# EAGLE design CoffeeHeater (EAGLE 9.2.0)
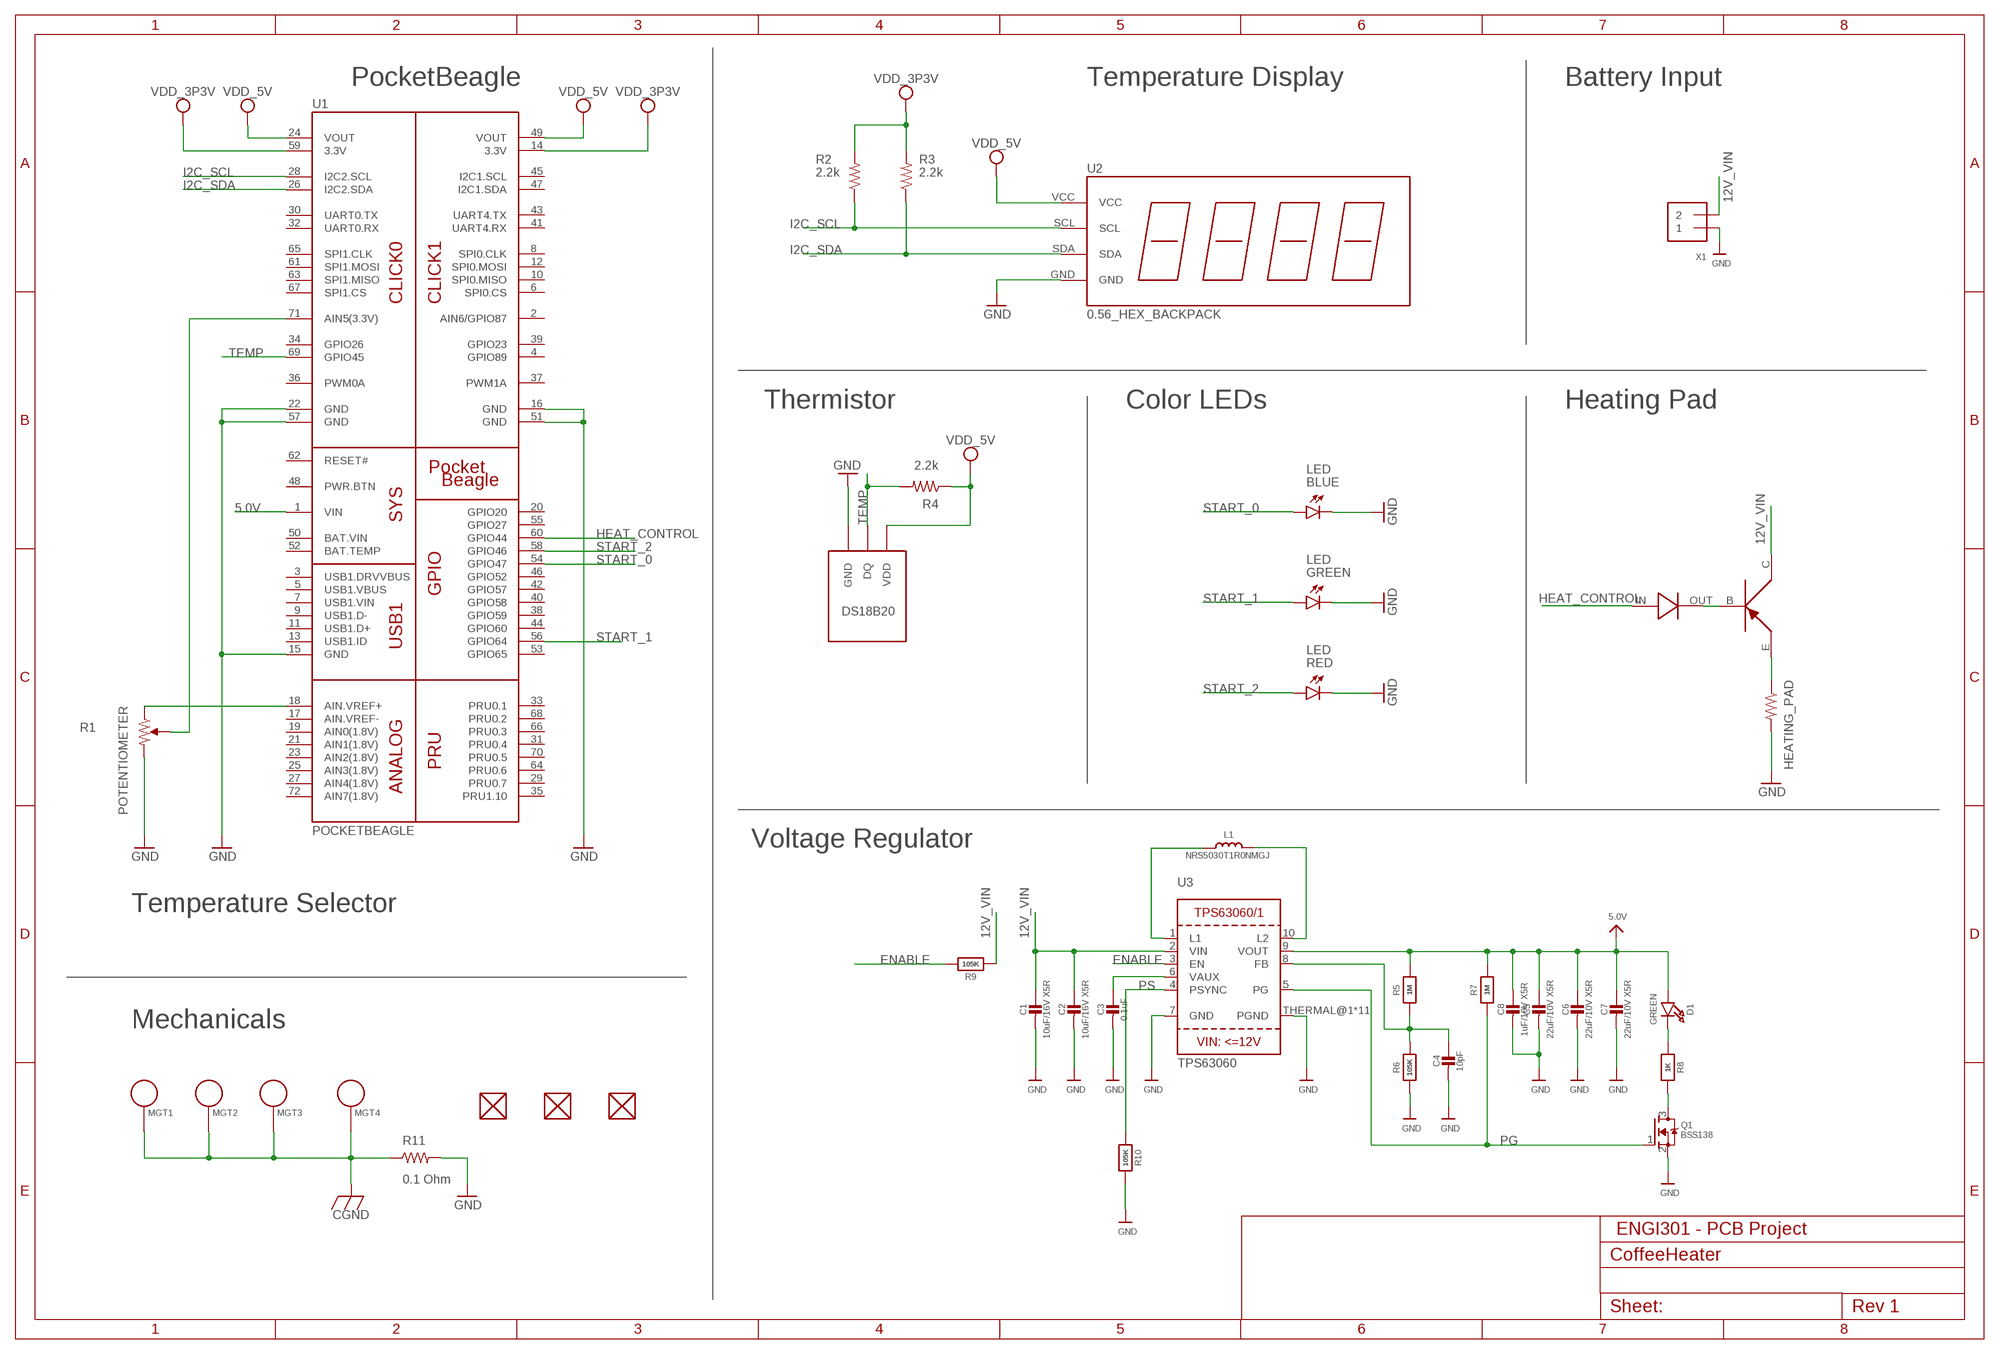
[diagram p0: schematic, sheet 1]

## Parts
BLUE  LED  [EIA-STD]
C1  10uF/16V X5R  CAP_CERAMIC0805-NOOUTLINE  [0805-NO]
C2  10uF/16V X5R  CAP_CERAMIC0805-NOOUTLINE  [0805-NO]
C3  0.1uF  CAP_CERAMIC0805-NOOUTLINE  [0805-NO]
C4  10pF  CAP_CERAMIC0805-NOOUTLINE  [0805-NO]
C5  22uF/10V X5R  CAP_CERAMIC0805-NOOUTLINE  [0805-NO]
C6  22uF/10V X5R  CAP_CERAMIC0805-NOOUTLINE  [0805-NO]
C7  22uF/10V X5R  CAP_CERAMIC0805-NOOUTLINE  [0805-NO]
C8  1uF/10V X5R  CAP_CERAMIC0805-NOOUTLINE  [0805-NO]
D1  GREEN  LED0805_NOOUTLINE  [CHIPLED_0805_NOOUTLINE]
D2  DIODE  [DIODE]
FUD1  FIDUCIAL  [FIDUCIAL_40MIL]
FUD2  FIDUCIAL  [FIDUCIAL_40MIL]
FUD3  FIDUCIAL  [FIDUCIAL_40MIL]
GREEN  LED  [EIA-STD]
H1  HEATING_PAD  [HEATING_PAD]
L1  NRS5030T1R0NMGJ  INDUCTORTDK_VLC5045  [INDUCTOR_5X5MM_TDK_VLC5045]
MGT1  MOUNTING_HOLE  [MOUNTING_HOLE]
MGT2  MOUNTING_HOLE  [MOUNTING_HOLE]
MGT3  MOUNTING_HOLE  [MOUNTING_HOLE]
MGT4  MOUNTING_HOLE  [MOUNTING_HOLE]
Q1  BSS138  MOSFET-NWIDE  [SOT23-WIDE]
R1  POTENTIOMETER  [POT-PO90S]
R2  2.2k  R_R0603  [R0603]
R3  2.2k  R_R0603  [R0603]
R4  2.2k  R_R0603  [R0603]
R5  1M  RESISTOR0805_NOOUTLINE  [0805-NO]
R6  105K  RESISTOR0805_NOOUTLINE  [0805-NO]
R7  1M  RESISTOR0805_NOOUTLINE  [0805-NO]
R8  1K  RESISTOR0805_NOOUTLINE  [0805-NO]
R9  105K  RESISTOR0805_NOOUTLINE  [0805-NO]
R10  105K  RESISTOR0805_NOOUTLINE  [0805-NO]
R11  0.1 Ohm  R_R0805  [R0805]
RED  LED  [EIA-STD]
T1  DS18B20_TEMP_SENSOR  [DS18B20_TEMP_SENSOR]
TR1  TIP32C_TRANSISTOR  [TIP32C_TRANSISTOR]
U1  POCKETBEAGLE  [POCKETBEAGLE]
U2  0.56_HEX_BACKPACK  [0.56_HEX_BACKPACK]
U3  TPS63060  VREG_TPS63060/1  [PWSON-N10]
X1  TERMBLOCK_1X2  [TERMBLOCK_1X2-3.5MM]

## Nets
5.0V: C5.1 C6.1 C7.1 C8.1 D1.A R5.2 R7.2 U1.1(VIN) U3.9(VOUT)
12V_VIN: C1.1 C2.1 R9.1 TR1.C U3.2(VIN) X1.2
BASE: D2.OUT TR1.B
CGND: MGT1.P$1 MGT2.P$1 MGT3.P$1 MGT4.P$1 R11.1
ENABLE: R9.2 U3.3(EN)
GND: BLUE.P$2(C) C1.2 C2.2 C3.2 C4.2 C5.2 C6.2 C7.2 C8.2 GREEN.P$2(C) H1.GND Q1.2(S) R1.CW R6.1 R10.2 R11.2 RED.P$2(C) T1.GND U1.15(GND) U1.16(GND) U1.22(GND) U1.51(GND) U1.57(GND) U2.GND U3.7(GND) U3.THERMAL@1(PGND) U3.THERMAL@5(PGND) U3.THERMAL@6(PGND) U3.THERMAL@7(PGND) U3.THERMAL@8(PGND) U3.THERMAL@9(PGND) U3.THERMAL@10(PGND) U3.THERMAL@11(PGND) U3.THERMAL@12(PGND) U3.THERMAL@13(PGND) U3.THERMAL@14(PGND) X1.1
HEAT_CONTROL: D2.IN U1.60(GPIO44)
I2C_SCL: R2.1 U1.28(I2C2.SCL) U2.SCL
I2C_SDA: R3.1 U1.26(I2C2.SDA) U2.SDA
N$1: H1.VDD TR1.E
N$2: R1.CCW U1.18(AIN.VREF+)
N$3: R1.S U1.71(AIN5(3.3V))
N$6: L1.P$1 U3.1(L1)
N$7: L1.P$2 U3.10(L2)
N$8: C3.1 U3.6(VAUX)
N$9: C4.1 R5.1 R6.2 U3.8(FB)
N$10: D1.C R8.1
N$11: Q1.3(D) R8.2
PG: Q1.1(G) R7.1 U3.5(PG)
PS: R10.1 U3.4(PSYNC)
START_0: BLUE.P$1(A) U1.54(GPIO47)
START_1: GREEN.P$1(A) U1.56(GPIO64)
START_2: RED.P$1(A) U1.58(GPIO46)
TEMP: R4.2 T1.DQ U1.69(GPIO45)
VDD_3P3V: R2.2 R3.2 U1.14(3.3V) U1.59(3.3V)
VDD_5V: R4.1 T1.VDD U1.24(VOUT) U1.49(VOUT) U2.VCC
Unconnected: FUD1.P$1 FUD2.P$1 FUD3.P$1 U1.2(AIN6/GPIO87) U1.3(USB1.DRVVBUS) U1.4(GPIO89) U1.5(USB1.VBUS) U1.6(SPI0.CS) U1.7(USB1.VIN) U1.8(SPI0.CLK) U1.9(USB1.D-) U1.10(SPI0.MISO) U1.11(USB1.D+) U1.12(SPI0.MOSI) U1.13(USB1.ID) U1.17(AIN.VREF-) U1.19(AIN0(1.8V)) U1.20(GPIO20) U1.21(AIN1(1.8V)) U1.23(AIN2(1.8V)) U1.25(AIN3(1.8V)) U1.27(AIN4(1.8V)) U1.29(PRU0.7) U1.30(UART0.TX) U1.31(PRU0.4) U1.32(UART0.RX) U1.33(PRU0.1) U1.34(GPIO26) U1.35(PRU1.10) U1.36(PWM0A) U1.37(PWM1A) U1.38(GPIO59) U1.39(GPIO23) U1.40(GPIO58) U1.41(UART4.RX) U1.42(GPIO57) U1.43(UART4.TX) U1.44(GPIO60) U1.45(I2C1.SCL) U1.46(GPIO52) U1.47(I2C1.SDA) U1.48(PWR.BTN) U1.52(BAT.TEMP) U1.53(GPIO65) U1.55(GPIO27) U1.61(SPI1.MOSI) U1.62(RESET#) U1.63(SPI1.MISO) U1.64(PRU0.6) U1.65(SPI1.CLK) U1.66(PRU0.3) U1.67(SPI1.CS) U1.68(PRU0.2) U1.70(PRU0.5) U1.72(AIN7(1.8V))

## Notes on the sheet
- PocketBeagle | Temperature Display | Battery Input
- Thermistor | Color LEDs | Heating Pad
- Voltage Regulator
- Temperature Selector
- Mechanicals
- ENGI301 - PCB Project

## Power pins joined to a net without a drawn wire
BAT.VIN: U1.50(BAT.VIN)

## Library data of the parts
BLUE GREEN RED = ENGI301:LED: LTST-C191TBKT Series of LEDs
C1-C8 = microbuilder:CAP_CERAMIC: Ceramic Capacitors For new designs, use the packages preceded by an '_' character since they are more reliable: The following footprints should be used on most boards: _0402 - Standard footprint for regular board layouts _0603 - Standard footprint for regular board layouts _0805 - Standard footprint for regular board layouts _1206 - Standard footprint for regular board layouts For extremely tight-pitch boards where space is at a premium, the following 'micro-pitch' footprints can be used (smaller pads, no silkscreen outline, etc.): _0402MP - Micro-pitch footprint for very dense/compact boards _0603MP - Micro-pitch footprint for very dense/compact boards _0805MP - Micro-pitch footprint for very dense/compact boards _1206MP - Micro-pitch footprint for very dense/compact boards
D1 = microbuilder:LED: LED 0603 - 0603 Surface Mount Package 2mA: Green LED - Low Power (3.9mcd, 2ma, 1.7Vf) - Digikey: 475-2709-2-ND Orange LED - Low Power (9.8mcd, 2ma, 1.8Vf) - Digikey: 475-1194-2-ND Red LED - Low Power (5mcd, 2ma, 1.8Vf) - Digikey: 475-1195-2-ND Yellow LED - Low Power (7mcd, 2ma, 1.8Vf) - Digikey: 475-1196-2-ND 5mA: Blue LED - Low Power (17mcd, 5ma, 2.9Vf) - Digikey: LNJ937W8CRACT-ND 0805 - 0805 Surface Mount Package 2mA: Red LED (8.8mcd, 2mA, 1.8Vf, Clear) - Low Power [Digikey: 475-2510-1-ND] Green LED (5mcd, 2mA, 1.8Vf, Clear) - Low Power [Digikey: 475-2730-1-ND] Yellow LED (11.3mcd, 2mA, 1.8Vf, Clear) - Low Power [Digikey: 475-2555-1-ND] 20mA: Red LED (104mcd, 20mA, Diffused) - LS R976 [Digikey: 475-1278-6-ND] Red LED (12mcd, 20mA, 2.0Vf, Clear) - APT2012EC [Digikey: 754-1128-1-ND] Green LED (15mcd, 20mA, 2.2Vf, Clear) - APT2012GC [Digikey: 754-1131-1-ND] Orange LED (160mcd, 20mA, 2.1Vf, Clear) - APT2012SECK [Digikey: 754-1130-1-ND] 1206 - 1206 Surface Mount Package Green LED (26mcd, 20mA, Diffused) - LG N971 [Digikey: 475-1407-6-ND] Red LED (15mcd, 20mA, Diffused) - LH N974 [Digikey: 475-1416-6-ND] Cree - Cree High-Power Surface Mount LEDs XPEBWT-L1-0000-00D50 - White 111lm 350mA 2.9Vf 6200K 110° XTEAWT-00-0000-00000LEE3 - White 114lm 350mA 2.85Vf 5000K 115° Everlight - Everlight 45-21 Series Surface Mount LEDs 45-21/QK2C-B2832AC2CB2/2T - Warm White 2000mcd 20mA 3.25Vf 3050K 120° 45-21/LK2C-B38452C4CB2/2T - Nuetral White 2000mcd 20mA 3.25Vf 4150K 120° 45-21/LK2C-B50634C6CB2/2T - Cold White 2200mcd 20mA 3.25Vf 5650K 120° PLCC2 Reverse Mount LS T77K-J1L2-1-0-2-R18-Z - Red 11.25mcd 2mA 1.8Vf 630nm 120° LO T77K-L1M2-24-Z - Orange 19.6mcd 2mA 1.8Vf 606nm 120° LY T77K-K2M1-26-Z - Yellow 15.7mcd 2mA 1.8Vf 587nm 120°
D2 = CoffeeHeater:DIODE: Standard diode
FUD1-FUD3 = Whac-a-mole:FIDUCIAL
H1 = CoffeeHeater:HEATING_PAD: Adafruit 12V heating pad
L1 = microbuilder:INDUCTOR: Inductors 0603: 10nH Ceramic Inductor - microwire antenna/RF (Digikey: 712-1434-2-ND) 0805: 560nH Ceramic Inductor - RF (Digikey: 553-1047-1-ND) 270nH Ceramic Inductor - Q = 40@250MHz, +-5%, 1 Ohm DC Resistance (Digikey: 535-10506-2-ND) 1007 (2518 Metric) SMT: 10µH 10% 250mOhm 820mA 1007 Inductor (Digikey: 587-2189-1-ND) 22µH 10% 500mOhm 580mA 1007 Inductor (Digikey: 587-2190-1-ND) 47µH 10% 950mOhm 420mA 1007 Inductor (Digikey: 587-2191-1-ND) 47µH 5% 100mOhm 1A 1008 Inductor (Digikey: 732-1816-1-ND) 5.0x5.0mm (Taiyo Yuden NR5040 Series) 6.8µH 20% 2.3A 64mOhm Inductor (Digikey: 587-2374-2-ND) 5.0x5.0mm (TDK VLC5045 Series) 4.7µH 20% 3.3A 34mOhm Inductor (Digikey: 445-6526-1-ND) 6.8µH 20% 2.7A 46mOhm Inductor (Digikey: 445-6527-1-ND) 6.0x6.0mm (TDK VLC6045 Series) 4.7µH 20% 3.8A 27mOhm Inductor (Digikey: 445-6538-2-ND) 6.8µH 20% 3A 41mOhm Inductor (Digikey: 445-6540-1-ND) 6.2µH 30% 2.2A 45mOhm Inductor (Digikey: SRR5028-6R2YCT-ND) - Not TDK VLC6045 but footprint should match 6.0x6.0mm (TDK SLF6045 Series) 6.8uH 30% 2A 33mOhm Inductor (Digikey: 445-4572-1-ND, Mouser: 810-SLF645T6R8N2R0PF) 6.0x6.0mm (Sumida CDRH5D28 Series) 6.2uH 30% 1.8A 45mOhm Inductor (Digikey: 308-1542-1-ND) Taiyo Yuden NR3015T2R2M - 2.2uH 20% 1.5A (Digikey: 587-1648-2-ND, Mouser: 963-NR3015T2R2M) - Used with TI TPS62172 CoilCraft RFID Transponder Coil - MA5532-AE (For use with AS3935 Lightning Sensor) Vishay IHLP 1.0uH Molded Inductor - 24mOhm DCR, 5A, +/-20%, -55°C-125°C (Digikey: 541-1319-1-ND)
MGT1-MGT4 = Whac-a-mole:MOUNTING_HOLE: Chassis Mounting Hole w/GND connection ability
Q1 = microbuilder:MOSFET-N: N-Channel Mosfet LEGEND VDS: Voltage Drain-Source ID: Drain Current RDS(ON): Drain-Source On-State Resistance VGS(TH): Gate-Source Threshold Voltage CISS: Drain-Source Input Capacitance SOT-23 Name VDS ID RDS(ON) VGS(TH) CISS Order Number 2N7002E 60V 260mA 2.5 Ohm 2.5V @ 250uA 26.7pF @ 25V 2N7002ET1GOSTR-ND BSH103 30V 850mA 400 mOhm 400mV @ 1mA 83pF @ 24V BSH103,235-ND BSS138 60V 320mA 1.6 Ohm 1.5V @ 250uA 50pF @ 10V Mouser: 771-BSS138PW115 DMN2075U-7 20V 4.2A 38 mOhm 1V @ 250 uA 594.3pF @ 10V DMN2075U-7DICT-ND * BSS138 good choice for I2C level-shifting POWERPAK 1212-8 Name VDS ID RDS(ON) VGS(TH) CISS Order Number Si7308DN 60V 6A 58 mOhm 3V @ 250uA 665pF @ 15V SI7308DN-T1-E3CT-ND
R1 = ENGI301:POTENTIOMETER: Potentiometer - Examples: P090S-14T20BR10K (987-1277-ND)
R2-R4 = ENGI301:R_: RESISTOR, American symbol
R5-R10 = microbuilder:RESISTOR: Resistors For new designs, use the packages preceded by an '_' character since they are more reliable: The following footprints should be used on most boards: _0402 - Standard footprint for regular board layouts _0603 - Standard footprint for regular board layouts _0805 - Standard footprint for regular board layouts _1206 - Standard footprint for regular board layouts For extremely tight-pitch boards where space is at a premium, the following 'micro-pitch' footprints can be used (smaller pads, no silkscreen outline, etc.): _0402MP - Micro-pitch footprint for very dense/compact boards _0603MP - Micro-pitch footprint for very dense/compact boards _0805MP - Micro-pitch footprint for very dense/compact boards _1206MP - Micro-pitch footprint for very dense/compact boards
R11 = Whac-a-mole:R_: RESISTOR, American symbol
T1 = CoffeeHeater:DS18B20_TEMP_SENSOR: Adafruit temperature sensor
TR1 = CoffeeHeater:TIP32C_TRANSISTOR: Power transistor
U1 = ENGI301:POCKETBEAGLE
U2 = ENGI301:0.56_HEX_BACKPACK: 0.56" LED HEX Backback - Adafruit HT16K33 - https://www.adafruit.com/product/878 - https://www.adafruit.com/product/879 - https://www.adafruit.com/product/880 - https://www.adafruit.com/product/881 - https://www.adafruit.com/product/1002
U3 = microbuilder:VREG_TPS63060/1: TPS63060/63061 2A Boost/Buck Switch Converter VIN: 2.5 - 12V Fixed frequency operation: 2.4MHz
X1 = microbuilder:TERMBLOCK_1X2: 3.5mm Terminal block http://www.ladyada.net/library/pcb/eaglelibrary.html

## Board
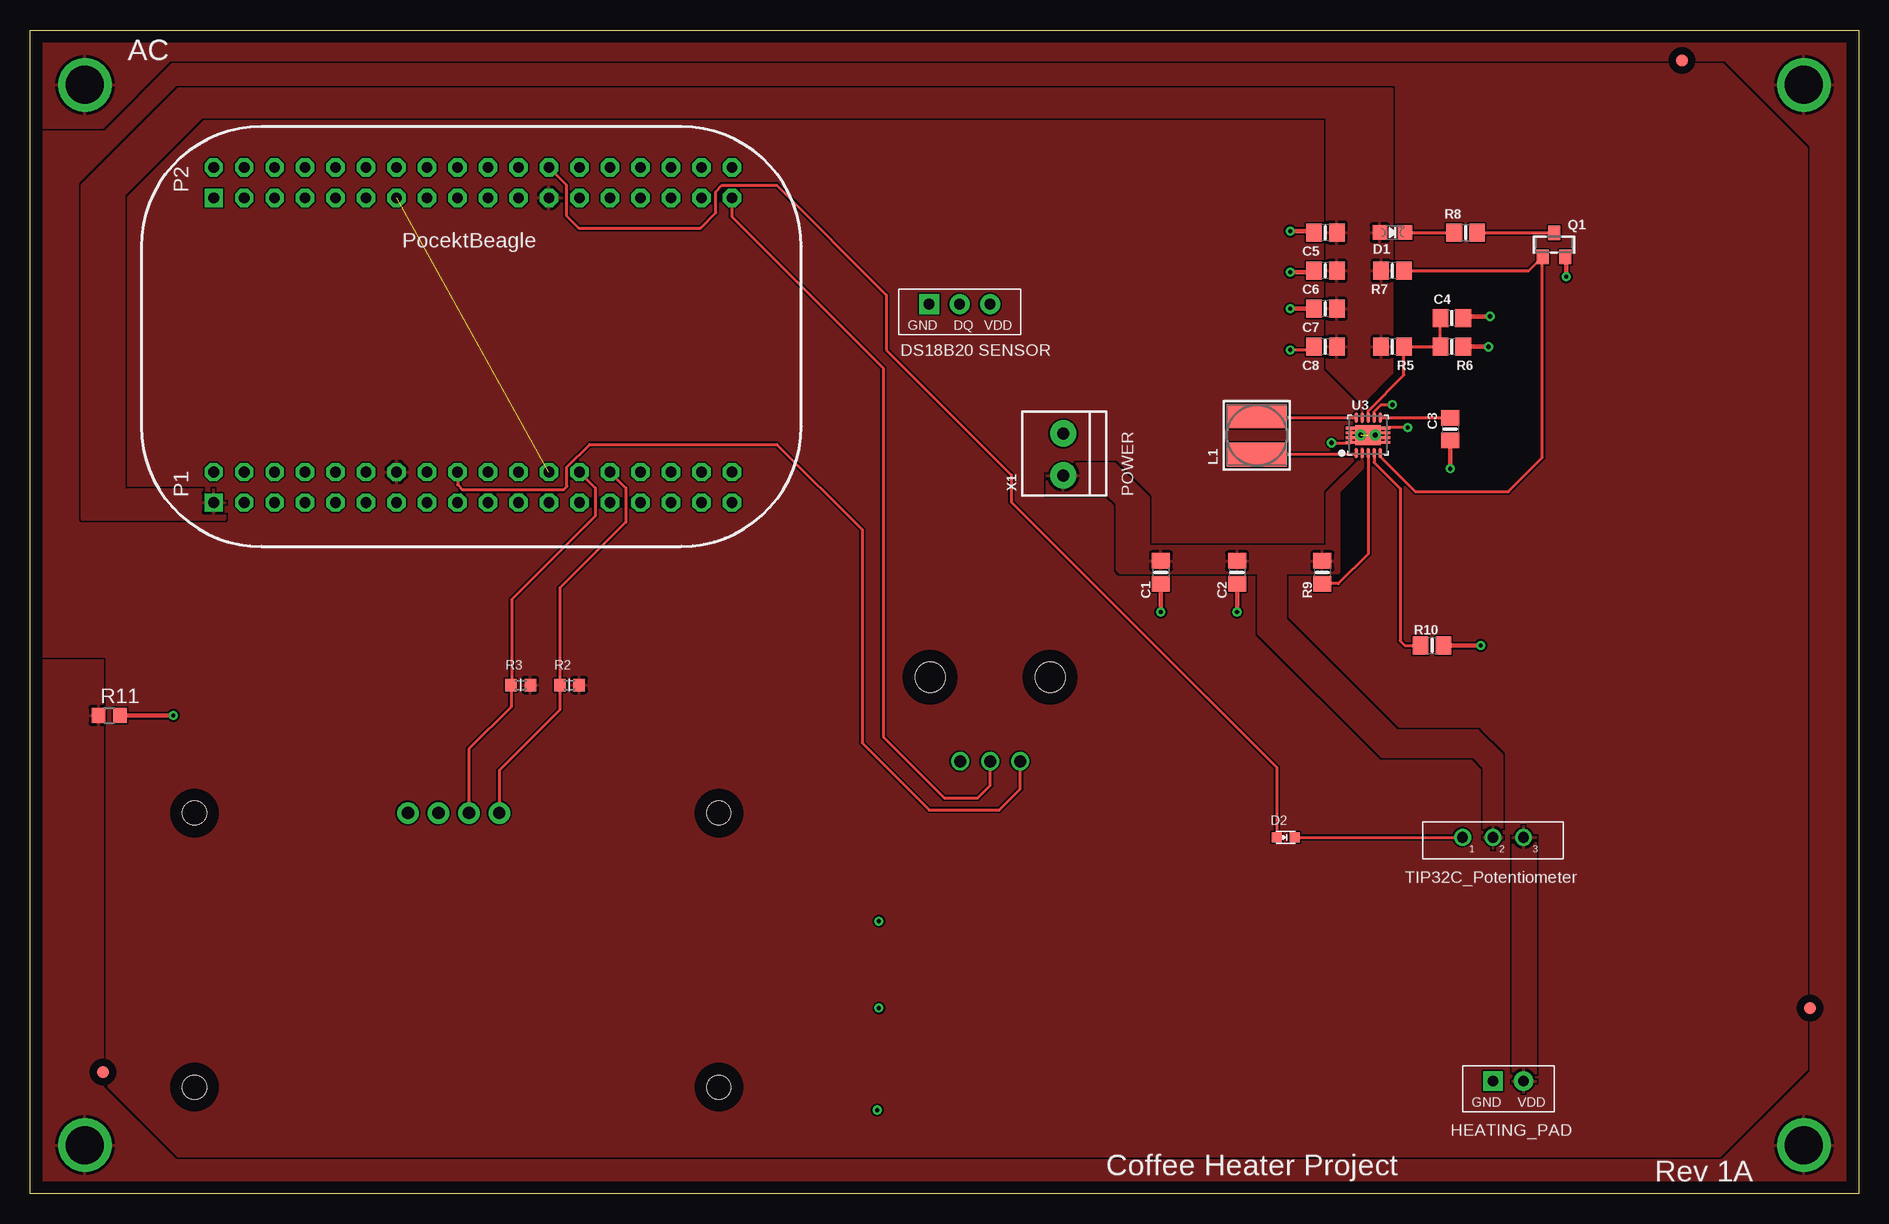
[diagram p1: board, top side]
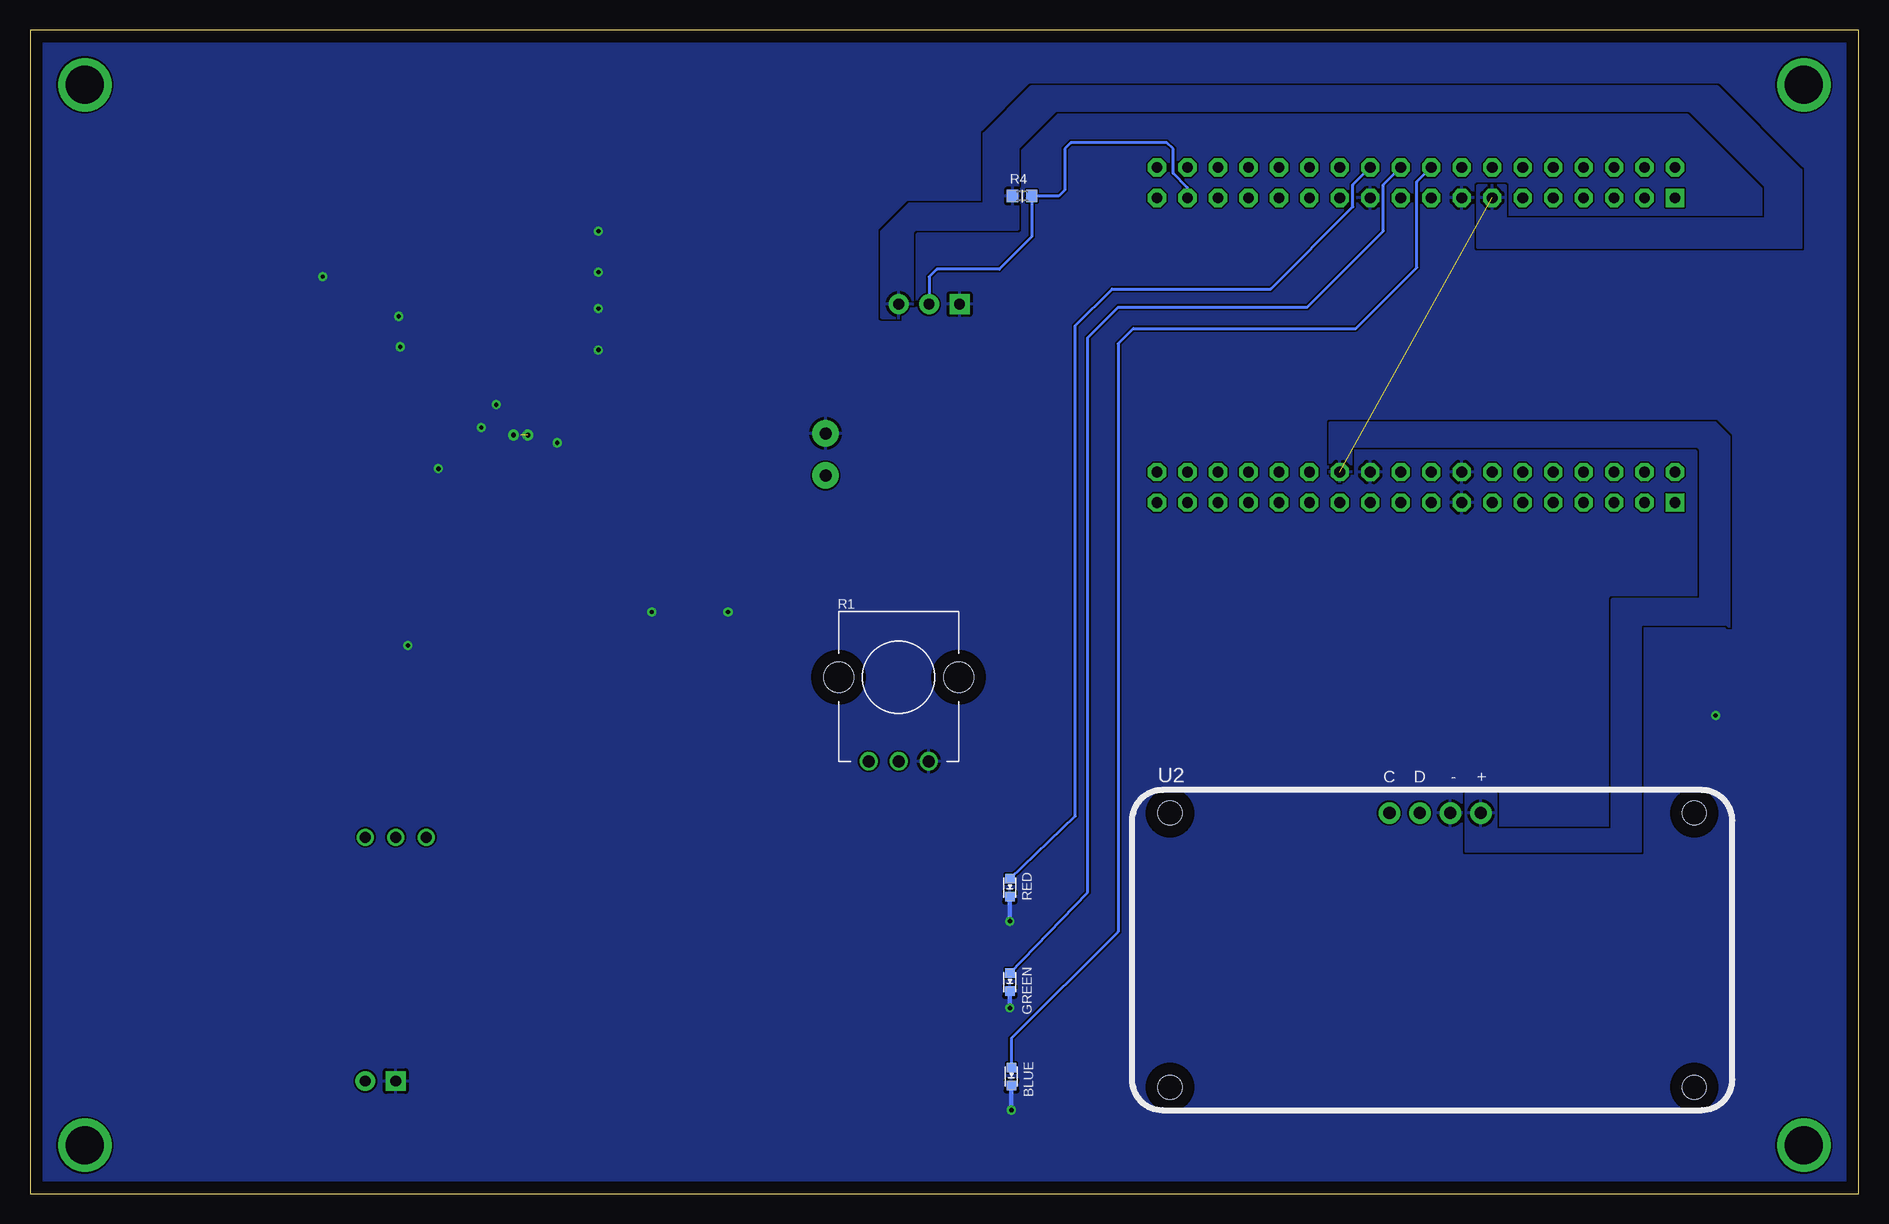
[diagram p2: board, bottom side, seen from below]

Size 152.4 x 97.03 mm. Coordinates in mm from the lower left corner, seen from the top.
Outline: 0,97.03 152.4,97.03 152.4,0 0,0 0,97.03
Copper layers (1*16): Top 0.035mm / dielectric 1.5mm / Bottom 0.035mm
Design rules "default *": minimum track width 10mil, minimum drill 0.35mm, track to track 6mil, track to pad 6mil, pad to pad 6mil, via to via 6mil, smd to smd 6mil, copper to edge 40mil, drill to drill 6mil, minimum pad ring 10mil, minimum via ring 8mil, stop-mask expansion 4mil, vias tented up to drill 0mil, thermal gap 10mil

### Footprints (pad centres in the part's own frame; a part is rotated, then mirrored left to right if it is on the bottom)
EIA-STD = smd 0.8 x 0.8: P$1 -0.75,0; P$2 0.75,0
0805-NO = smd 1.3 x 1.5: 1 -0.95,0; 2 0.95,0
CHIPLED_0805_NOOUTLINE = smd 1.2 x 1.2: A 0,-1.05; C 0,1.05
DIODE = smd 0.8 x 0.8: IN -0.75,0; OUT 0.75,0
FIDUCIAL_40MIL = smd 1.016 x 1.016: P$1 0,0
HEATING_PAD = drill 0.889 pad 1.651 square: GND -2.54,0 | drill 0.889 pad 1.651: VDD 0,0
INDUCTOR_5X5MM_TDK_VLC5045 = smd 2 x 5: P$1 -1.6,0; P$2 1.6,0
MOUNTING_HOLE = drill 3.175 pad 4.445: P$1 0,0
SOT23-WIDE = smd 1 x 1.2: 1 -0.95,-1; 2 0.95,-1; 3 0,1
POT-PO90S = drill 1: CCW -2.5,0; CW 2.5,0; S 0,0 | hole 2.5: -5,7; 5,7
R0603 = smd 0.95 x 1.031: 1 -0.8,0; 2 0.8,0
R0805 = smd 1.143 x 1.27: 1 -0.889,0; 2 0.889,0
DS18B20_TEMP_SENSOR = drill 0.889 pad 1.651: DQ 0,0; VDD 2.54,0 | drill 0.889 pad 1.651 square: GND -2.54,0
TIP32C_TRANSISTOR = drill 0.9: B -2.54,0; C 0,0; E 2.54,0
POCKETBEAGLE = drill 0.889 pad 1.524 square: 1 5.91,3.53; 37 5.91,28.93 | drill 0.889 pad 1.524 octagon: 2 5.91,6.07; 3 8.45,3.53; 4 8.45,6.07; 5 10.99,3.53; 6 10.99,6.07; 7 13.53,3.53; 8 13.53,6.07; 9 16.07,3.53; 10 16.07,6.07; 11 18.61,3.53; 12 18.61,6.07; 13 21.15,3.53; 14 21.15,6.07; 15 23.69,3.53; 16 23.69,6.07; 17 26.23,3.53; 18 26.23,6.07; 19 28.77,3.53; 20 28.77,6.07; 21 31.31,3.53; 22 31.31,6.07; 23 33.85,3.53; 24 33.85,6.07; 25 36.39,3.53; 26 36.39,6.07; 27 38.93,3.53; 28 38.93,6.07; 29 41.47,3.53; 30 41.47,6.07; 31 44.01,3.53; 32 44.01,6.07; 33 46.55,3.53; 34 46.55,6.07; 35 49.09,3.53; 36 49.09,6.07; 38 5.91,31.47; 39 8.45,28.93; 40 8.45,31.47; 41 10.99,28.93; 42 10.99,31.47; 43 13.53,28.93; 44 13.53,31.47; 45 16.07,28.93; 46 16.07,31.47; 47 18.61,28.93; 48 18.61,31.47; 49 21.15,28.93; 50 21.15,31.47; 51 23.69,28.93; 52 23.69,31.47; 53 26.23,28.93; 54 26.23,31.47; 55 28.77,28.93; 56 28.77,31.47; 57 31.31,28.93; 58 31.31,31.47; 59 33.85,28.93; 60 33.85,31.47; 61 36.39,28.93; 62 36.39,31.47; 63 38.93,28.93; 64 38.93,31.47; 65 41.47,28.93; 66 41.47,31.47; 67 44.01,28.93; 68 44.01,31.47; 69 46.55,28.93; 70 46.55,31.47; 71 49.09,28.93; 72 49.09,31.47
0.56_HEX_BACKPACK = drill 1.016 pad 1.778: GND 1.524,11.43; SCL -3.556,11.43; SDA -1.016,11.43; VCC 4.064,11.43 | hole 2: -21.844,-11.43; 21.844,-11.43; -21.844,11.43; 21.844,11.43
PWSON-N10 = smd 0.28 x 0.85: 1 -1,-1.475; 2 -0.5,-1.475; 3 0,-1.475; 4 0.5,-1.475; 5 1,-1.475; 6 1,1.475; 7 0.5,1.475; 8 0,1.475; 9 -0.5,1.475; 10 -1,1.475 | smd 2.15 x 1.66: THERMAL@1 0,0 | drill 0.4 pad 0.6: THERMAL@5 -0.6,0; THERMAL@6 0.6,0 | smd 0.8 x 0.23: THERMAL@7 1.46,0.6; THERMAL@8 1.46,0.2; THERMAL@9 1.46,-0.2; THERMAL@10 1.46,-0.6; THERMAL@11 -1.46,-0.6; THERMAL@12 -1.46,-0.2; THERMAL@13 -1.46,0.2; THERMAL@14 -1.46,0.6
TERMBLOCK_1X2-3.5MM = drill 1 pad 2.184: 1 1.8,0; 2 -1.7,0

### Placement (x,y rotation side)
BLUE  70.61,9.78 270 bottom
C1  94.23,51.82 270 top
C2  100.58,51.82 270 top
C3  118.36,63.75 270 top
C4  118.49,73.02 0 top
C5  107.95,80.14 180 top
C6  107.95,76.96 180 top
C7  107.95,73.79 180 top
C8  107.95,70.61 180 top
D1  113.54,80.14 270 top
D2  104.65,29.72 0 top
FUD1  6.1,10.16 0 top
FUD2  137.67,94.49 0 top
FUD3  148.34,15.49 0 top
GREEN  70.74,17.65 270 bottom
H1  124.46,9.4 0 top
L1  102.23,63.25 90 top
MGT1  4.57,4.06 0 top
MGT2  4.57,92.46 0 top
MGT3  147.83,4.06 0 top
MGT4  147.83,92.46 0 top
Q1  127,79.12 0 top
R1  80.01,36.07 0 bottom
R2  44.96,42.42 0 top
R3  40.89,42.42 0 top
R4  69.72,83.19 0 bottom
R5  113.54,70.61 180 top
R6  118.49,70.61 180 top
R7  113.54,76.96 180 top
R8  119.63,80.14 0 top
R9  107.7,51.82 270 top
R10  116.84,45.72 0 top
R11  6.6,39.88 0 top
RED  70.74,25.53 270 bottom
T1  77.47,74.17 0 top
TR1  121.92,29.72 0 top
U1  9.4,54.1 0 top
U2  35.56,20.32 0 bottom
U3  111.51,63.25 0 top
X1  86.11,61.59 90 top

### Tracks (layer width: path | path; a pad name or v marks a point on that pad's centre or on a via)
5.0V
  pour Top: 16.26,58.67 7.87,58.67 7.87,83.31 14.35,89.79 108.08,89.79 108.08,68.83 110.93,65.98 110.93,64.39 111.06,64.39 111.06,65.98 113.54,68.45 113.54,92.08 12.32,92.08 4.32,84.07 4.32,56.26 16.26,56.26
12V_VIN
  pour Top (rank 3): 84.71,60.83 84.71,58.29 89.79,58.29 90.55,57.53 90.55,52.07 90.81,51.82 102.36,51.82 102.36,46.74 112.65,36.45 120.27,36.45 121.16,35.56 121.16,28.83 122.68,28.83 122.68,36.58 120.65,38.61 113.92,38.61 104.65,47.88 104.65,51.82 109.09,51.82 109.09,58.55 111.06,60.52 111.06,62.1 110.93,62.1 110.93,61.28 108.08,58.42 108.08,53.97 93.22,53.97 93.22,58.04 90.42,60.83
BASE
  Top 0.254: D2.OUT TR1.B
CGND
  pour Top (rank 2): 0,88.9 6.1,88.9 11.68,94.49 141.22,94.49 148.34,87.38 148.34,10.16 140.97,2.79 12.19,2.79 6.1,8.89 6.1,44.45 0,44.45 0,0.25 152.4,0.25 152.4,97.03 0,97.03
ENABLE
  Top 0.254: R9.2 109.03,50.87 111.51,53.34 U3.3
GND  (via drill 0.35)  (1 unrouted)
  Top 0.254: U3.THERMAL@14 U3.THERMAL@13 U3.THERMAL@12 U3.THERMAL@11 110.01,62.61 v108.46,62.61 | U3.THERMAL@10 U3.THERMAL@9 U3.THERMAL@8 U3.THERMAL@7 113,63.88 v114.81,63.88 | C6.2 106.87,76.83 | C8.2 106.75,70.36 v105.03,70.36 | C5.2 106.87,80.26 | U3.7 112.01,64.73 112.01,65.21 112.59,65.79 v113.54,65.79
  Top 0.381: R10.2 v120.9,45.72 | C1.2 v94.23,48.51 | C2.2 v100.58,48.51 | R11.2 v11.94,39.88 | 106.87,76.83 v105.03,76.83 | C7.2 v105.03,73.79 | 106.87,80.26 v105.03,80.26 | v121.67,73.15 119.57,73.15 C4.2 | v121.54,70.61 R6.1 | v128.02,76.45 128.02,78.05 Q1.2 | C3.2 v118.36,60.45
  Bottom 0.381: RED.P$2 70.74,22.99 70.82,22.65 | GREEN.P$2 v70.74,15.49 | BLUE.P$2 v70.61,6.99
  other vias: 70.74,22.73
  pour Bottom (rank 6): -2.54,99.57 -2.54,-7.11 154.94,-7.11 154.94,99.57
HEAT_CONTROL
  Top 0.254: U1.60 44.7,84.12 44.7,81.53 45.72,80.52 55.88,80.52 57.15,81.79 57.15,83.57 57.66,84.07 62.23,84.07 71.37,74.93 71.37,70.36 81.79,59.94 81.79,57.66 103.9,35.55 D2.IN
I2C_SCL
  Top 0.254: U2.SCL 39.12,35.31 44.16,40.35 R2.1 44.16,50.51 49.66,56.01 49.66,58.84 U1.28
I2C_SDA
  Top 0.254: U1.26 47.12,58.84 47.12,56.52 40.13,49.53 40.13,42.46 R3.1 40.09,40.6 36.58,37.08 U2.SDA
N$1
  pour Top: 123.57,30.61 123.57,8.51 125.48,8.51 125.48,30.61
N$2
  Top 0.254: R1.CCW 82.51,33.74 80.77,32 74.93,32 69.34,37.59 69.34,55.37 62.23,62.48 46.63,62.48 44.75,60.6 44.75,58.97 44.45,58.67 36.07,58.67 35.63,59.11 U1.18
N$3
  Top 0.254: U1.71 58.49,81.47 71.12,68.83 71.12,38.1 76.2,33.02 78.99,33.02 80.01,34.04 R1.S
N$6
  Top 0.254: U3.1 110.38,61.65 L1.P$1
N$7
  Top 0.254: L1.P$2 102.36,64.72 U3.10
N$8
  Top 0.254: U3.6 118.35,64.72 C3.1
N$9
  Top 0.254: U3.8 111.51,65.28 114.49,68.26 R5.1 R6.2 C4.1
N$10
  Top 0.254: D1.C R8.1
N$11
  Top 0.254: R8.2 126.98,80.14 Q1.3
PG
  Top 0.254: U3.5 112.51,61.48 114.62,59.37 114.81,59.18 115.44,58.55 123.19,58.55 126.01,61.37 126.01,78.08 | R7.1 124.89,76.96 126.01,78.08 | 126.01,78.08 Q1.1
PS
  Top 0.254: U3.4 112.01,60.97 114.17,58.8 114.17,46.1 114.55,45.72 R10.1
START_0
  Bottom 0.254: BLUE.P$1 70.61,12.95 61.72,21.84 61.72,70.87 60.45,72.14 41.91,72.14 36.83,77.22 36.83,84.37 U1.54
START_1
  Bottom 0.254: GREEN.P$1 64.26,25.13 64.26,71.37 61.72,73.91 45.97,73.91 39.62,80.26 39.62,84.12 U1.56
START_2
  Bottom 0.254: RED.P$1 65.28,31.5 65.28,72.39 62.23,75.44 49.02,75.44 42.16,82.3 42.16,84.12 U1.58
TEMP
  Bottom 0.152: R4.2 69.34,83.02
  Bottom 0.254: U1.69 55.95,83.89 57.15,85.09 57.15,87.12 57.66,87.63 65.66,87.63 66.17,87.12 66.17,83.69 66.67,83.19 R4.2 68.92,79.79 71.63,77.09 76.83,77.09 77.47,76.45 T1.DQ
VDD_3P3V
  pour Top (rank 6): -0.7,98.3 -0.7,-0.76 153.67,-0.76 153.67,98.3
VDD_5V  (1 unrouted)
  pour Bottom: 44.07,64.26 44.07,59.44 42.29,59.44 42.29,62.36 13.46,62.36 13.21,62.1 13.21,49.66 13.08,49.53 20.57,49.53 20.57,30.35 30.23,30.35 30.23,33.53 32.77,33.53 32.77,28.57 18.16,28.57 18.16,47.37 18.29,47.5 11.05,47.5 10.79,47.24 10.79,63.12 11.94,64.26
  pour Bottom: 29.46,84.07 29.46,81.41 29.34,81.28 7.75,81.28 7.75,83.95 14.1,90.3 66.93,90.3 70.1,87.12 70.1,80.39 78.61,80.39 78.87,80.14 78.87,73.02 81.41,73.02 81.41,80.26 79.12,82.55 72.9,82.55 72.9,88.39 68.96,92.33 11.81,92.33 4.83,85.34 4.83,78.87 31.75,78.87 31.75,84.07

### Text on the board
tPlace: DS18B20 SENSOR | POWER | TIP32C_Potentiometer | HEATING_PAD
tNames: AC | Coffee Heater Project | Rev 1A